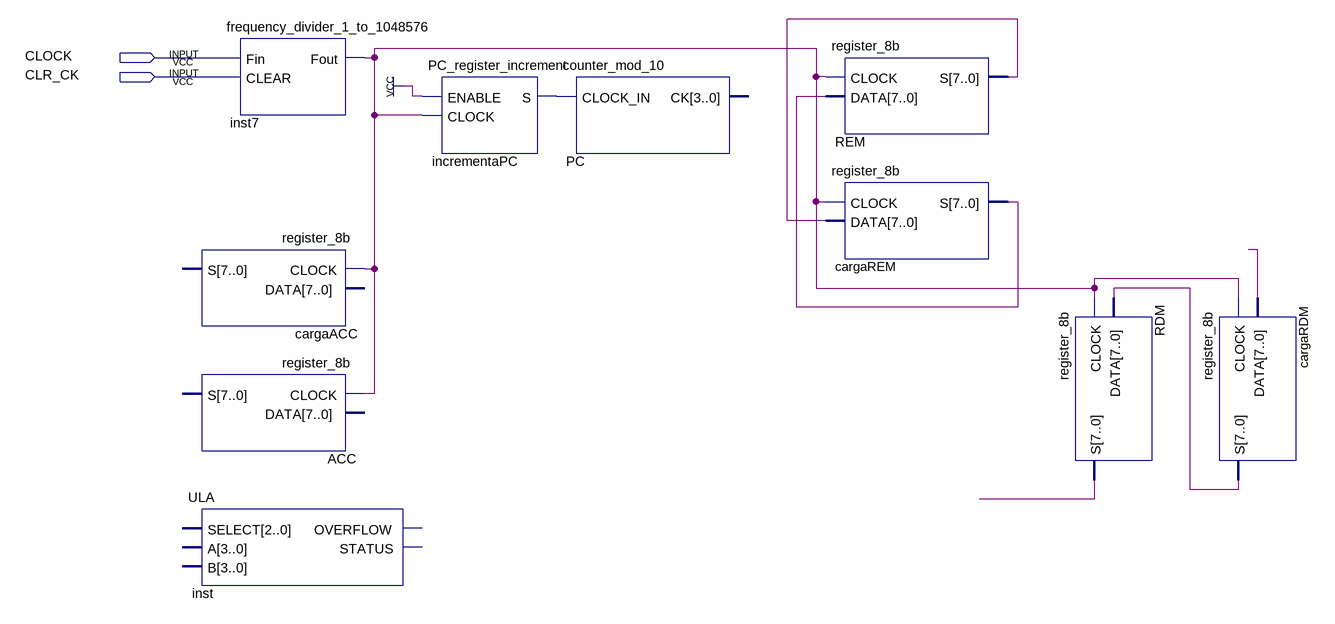
[diagram p0: schematic sheet]
// Quartus schematic neander.bdf as structural Verilog: 10 symbols, 2 pins
module neander (
  input  CLOCK,
  input  CLR_CK
);

  wire incrementaPC_s, inst7_fout, RDM_s, undriven;
  wire [7:0] cargaRDM_s, cargaREM_s, REM_s;

  register_8b cargaACC (.CLOCK(inst7_fout));  // open: DATA, S
  register_8b ACC (.CLOCK(inst7_fout));  // open: DATA, S
  ULA inst ();  // open: SELECT, A, B, OVERFLOW, STATUS
  frequency_divider_1_to_1048576 inst7 (.Fin(CLOCK), .CLEAR(CLR_CK), .Fout(inst7_fout));
  PC_register_increment incrementaPC (.ENABLE(1'b1), .CLOCK(inst7_fout), .S(incrementaPC_s));
  counter_mod_10 PC (.CLOCK_IN(incrementaPC_s));  // open: CK
  register_8b REM (.CLOCK(inst7_fout), .DATA(cargaREM_s), .S(REM_s));
  register_8b cargaREM (.CLOCK(inst7_fout), .DATA(REM_s), .S(cargaREM_s));
  register_8b RDM (.CLOCK(inst7_fout), .DATA(cargaRDM_s), .S(RDM_s));
  register_8b cargaRDM (.CLOCK(inst7_fout), .DATA({8{undriven}}), .S(cargaRDM_s));
endmodule
